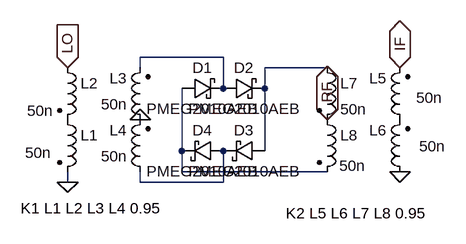
[diagram p0: schematic mixer.asc]
mixer.asc, the LTspice schematic file:
Version 4
SHEET 1 1072 680
WIRE 256 32 128 32
WIRE 128 48 128 32
WIRE 416 48 320 48
WIRE 256 80 256 32
WIRE 320 80 320 48
WIRE 192 176 192 80
WIRE 320 176 320 80
WIRE 192 208 192 176
WIRE 416 208 192 208
WIRE 16 224 16 208
WIRE 128 224 128 208
WIRE 256 224 256 176
WIRE 256 224 128 224
FLAG 416 128 RF
IOPIN 416 128 BiDir
FLAG 16 48 LO
IOPIN 16 48 In
FLAG 528 48 IF
IOPIN 528 48 BiDir
FLAG 528 208 0
FLAG 16 224 0
FLAG 128 128 0
SYMBOL ind2 0 112 R0
WINDOW 3 -49 67 Left 2
SYMATTR Value 50n
SYMATTR InstName L1
SYMATTR Type ind
SYMBOL ind2 0 32 R0
WINDOW 3 -46 82 Left 2
SYMATTR Value 50n
SYMATTR InstName L2
SYMATTR Type ind
SYMBOL ind2 144 144 R180
WINDOW 0 36 80 Left 2
WINDOW 3 36 40 Left 2
SYMATTR InstName L3
SYMATTR Value 50n
SYMATTR Type ind
SYMBOL ind2 144 224 R180
WINDOW 0 36 80 Left 2
WINDOW 3 36 40 Left 2
SYMATTR InstName L4
SYMATTR Value 50n
SYMATTR Type ind
SYMBOL ind2 544 144 R180
WINDOW 0 36 80 Left 2
WINDOW 3 -50 50 Left 2
SYMATTR InstName L5
SYMATTR Value 50n
SYMATTR Type ind
SYMBOL ind2 544 224 R180
WINDOW 0 36 80 Left 2
WINDOW 3 -54 55 Left 2
SYMATTR InstName L6
SYMATTR Value 50n
SYMATTR Type ind
SYMBOL ind2 400 32 R0
SYMATTR InstName L7
SYMATTR Value 50n
SYMATTR Type ind
SYMBOL ind2 400 112 R0
WINDOW 3 35 87 Left 2
SYMATTR Value 50n
SYMATTR InstName L8
SYMATTR Type ind
SYMBOL schottky 192 96 R270
WINDOW 0 32 32 VTop 2
WINDOW 3 0 32 VBottom 2
SYMATTR InstName D1
SYMATTR Value PMEG2010AEB
SYMATTR Description Diode
SYMATTR Type diode
SYMBOL schottky 256 96 R270
WINDOW 0 32 32 VTop 2
WINDOW 3 0 32 VBottom 2
SYMATTR InstName D2
SYMATTR Value PMEG2010AEB
SYMATTR Description Diode
SYMATTR Type diode
SYMBOL schottky 320 160 R90
WINDOW 0 0 32 VBottom 2
WINDOW 3 32 32 VTop 2
SYMATTR InstName D3
SYMATTR Value PMEG2010AEB
SYMATTR Description Diode
SYMATTR Type diode
SYMBOL schottky 256 160 R90
WINDOW 0 0 32 VBottom 2
WINDOW 3 32 32 VTop 2
SYMATTR InstName D4
SYMATTR Value PMEG2010AEB
SYMATTR Description Diode
SYMATTR Type diode
TEXT -56 264 Left 2 !K1 L1 L2 L3 L4 0.95
TEXT 352 272 Left 2 !K2 L5 L6 L7 L8 0.95

The netlist it stands for:
* mixer.asc
L1 P001 0 50n
L2 LO P001 50n
L3 0 N001 50n
L4 N004 0 50n
L5 P002 IF 50n
L6 0 P002 50n
L7 N002 RF 50n
L8 RF N003 50n
D1 N003 N001 PMEG2010AEB
D2 N001 N002 PMEG2010AEB
D3 N002 N004 PMEG2010AEB
D4 N004 N003 PMEG2010AEB
.model D D
.lib standard.dio
K1 L1 L2 L3 L4 0.95
K2 L5 L6 L7 L8 0.95
.backanno
.end